# Altium project TDA_7000_FM_RECIEVER.PrjPcb
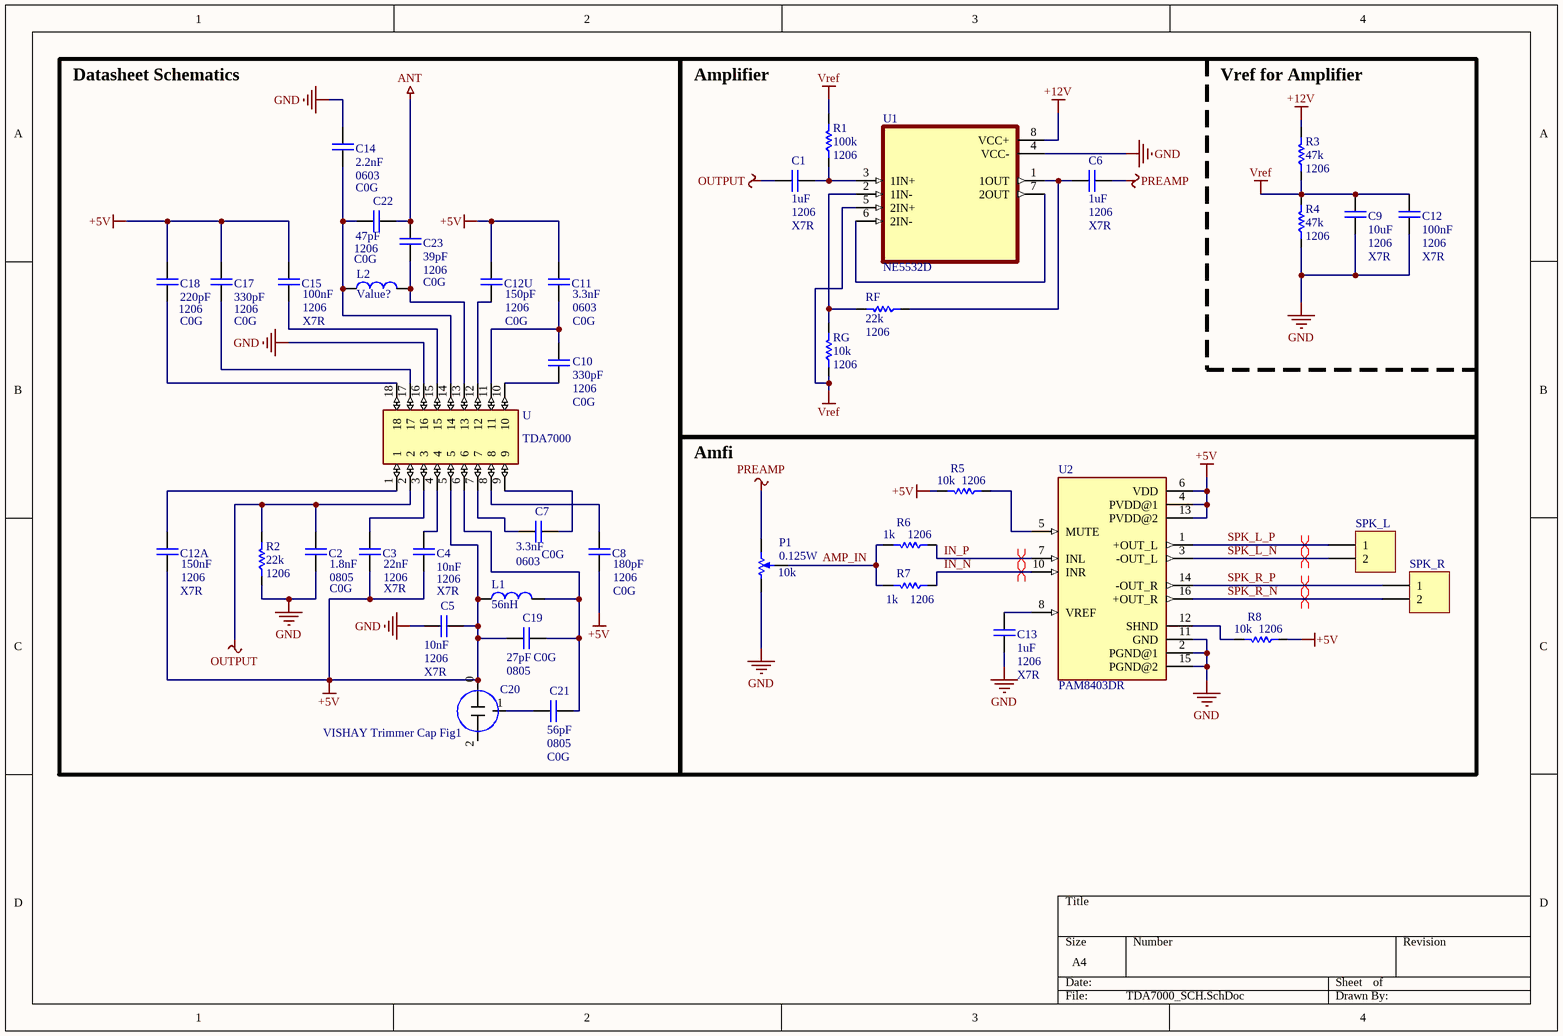
[diagram p0: TDA7000_SCH.SchDoc]
1 sheet, 42 parts. Net scope: global (net labels, ports and power ports of the same name join across sheets).
Board file: TDA7000_PCB.PcbDoc

## Sheet TDA7000_SCH.SchDoc
size A4; SheetNumber: 1; SheetTotal: 1

### Parts
C1  Package: 1206  Rating: X7R  [CAP 1206/3216]  (hidden comment: 1uF)
C2  Package: 0805  Rating: C0G  [CAP 0805/2012]  (hidden comment: 1.8nF)
C3  Package: 1206  Rating: X7R  [CAP 1206/3216]  (hidden comment: 22nF)
C4  Package: 1206  Rating: X7R  [CAP 1206/3216]  (hidden comment: 10nF)
C5  Package: 1206  Rating: X7R  [CAP 1206/3216]  (hidden comment: 10nF)
C6  Package: 1206  Rating: X7R  [CAP 1206/3216]  (hidden comment: 1uF)
C7  Package: 0603  Rating: C0G  [CAP 0603/1608]  (hidden comment: 3.3nF)
C8  Package: 1206  Rating: C0G  [CAP 1206/3216]  (hidden comment: 180pF)
C9  Package: 1206  Rating: X7R  [CAP 1206/3216]  (hidden comment: 10uF)
C10  Package: 1206  Rating: C0G  [CAP 1206/3216]  (hidden comment: 330pF)
C11  Package: 0603  Rating: C0G  [CAP 0603/1608]  (hidden comment: 3.3nF)
C12  Package: 1206  Rating: X7R  [CAP 1206/3216]  (hidden comment: 100nF)
C12A  Package: 1206  Rating: X7R  [CAP 1206/3216]  (hidden comment: 150nF)
C12U  Package: 1206  Rating: C0G  [CAP 1206/3216]  (hidden comment: 150pF)
C13  Package: 1206  Rating: X7R  [CAP 1206/3216]  (hidden comment: 1uF)
C14  Package: 0603  Rating: C0G  [CAP 0603/1608]  (hidden comment: 2.2nF)
C15  Package: 1206  Rating: X7R  [CAP 1206/3216]  (hidden comment: 100nF)
C17  Package: 1206  Rating: C0G  [CAP 1206/3216]  (hidden comment: 330pF)
C18  Package: 1206  Rating: C0G  [CAP 1206/3216]  (hidden comment: 220pF)
C19  Package: 0805  Rating: C0G  [CAP 1206/3216]  (hidden comment: 27pF)
C20  VISHAY Trimmer Cap Fig1  [FIG2]
C21  Package: 0805  Rating: C0G  [CAP 0805/2012]  (hidden comment: 56pF)
C22  Package: 1206  Rating: C0G  [CAP 1206/3216]  (hidden comment: 47pF)
C23  Package: 1206  Rating: C0G  [CAP 1206/3216]  (hidden comment: 39pF)
L1  56nH  [Inductor - 10uH (1/8)]
L2  Value?  [Inductor - 10uH (1/8)]
P1  Rating: 0.125W  [POT_WH148]  (hidden comment: 10k)
R1  Package: 1206  [RES 1206 (3216X08L)]  (hidden comment: 100k)
R2  Package: 1206  [RES 1206 (3216X08L)]  (hidden comment: 22k)
R3  Package: 1206  [RES 1206 (3216X08L)]  (hidden comment: 47k)
R4  Package: 1206  [RES 1206 (3216X08L)]  (hidden comment: 47k)
R5  Package: 1206  [RES 1206 (3216X08L)]  (hidden comment: 10k)
R6  Package: 1206  [RES 1206 (3216X08L)]  (hidden comment: 1k)
R7  Package: 1206  [RES 1206 (3216X08L)]  (hidden comment: 1k)
R8  Package: 1206  [RES 1206 (3216X08L)]  (hidden comment: 10k)
RF  Package: 1206  [RES 1206 (3216X08L)]  (hidden comment: 22k)
RG  Package: 1206  [RES 1206 (3216X08L)]  (hidden comment: 10k)
SPK_L  2  [HDR_THT_2F_2.54mm]  (value not drawn)
SPK_R  2  [HDR_THT_2F_2.54mm]  (value not drawn)
U  TDA7000  [DIP802W45P254L2180H470Q18]
U1  NE5532D  [SOIC127P599X175-8N]
U2  PAM8403DR  [SOIC127P605X150-16N]

### Blocks framed on the sheet
Datasheet Schematics: C2-C5 C7 C8 C10 C11 C12A C12U C14 C15 C17-C23 L1 L2 R2 U
Amplifier: C1 C6 R1 RF RG U1
Vref for Amplifier: C9 C12 R3 R4
Amfi: C13 P1 R5-R8 SPK_L SPK_R U2

### Nets
+5V: C3.2 C4.2 C5.2 C8.1 C11.2 C12A.2 C12U.2 C15.1 C17.1 C18.1 C19.1 C20.0 L1.1 R5.2 R8.1 U.5 U2.4(PVDD@1) U2.6(VDD) U2.13(PVDD@2)
+12V: R3.2 U1.8(VCC+)
ANT: C22.2 C23.2
GND: C2.2 C5.1 C9.1 C12.1 C13.1 C14.2 P1.3(CW) R2.1 R4.1 U.16 U1.4(VCC-) U2.2(PGND@1) U2.11(GND) U2.15(PGND@2)
OUTPUT: C1.1 C2.1 R2.2 U.2
PREAMP: C6.2 P1.1(CCW)
Vref: C9.2 C12.2 R1.2 R3.1 R4.2 RG.1 U1.5(2IN+)
AMP_IN: P1.2(WIPER) R6.2 R7.2
IN_N: R7.1 U2.10(INR)
IN_P: R6.1 U2.7(INL)
SPK_L_N: SPK_L.2 U2.3(-OUT_L)
SPK_L_P: SPK_L.1 U2.1(+OUT_L)
SPK_R_N: SPK_R.2 U2.16(+OUT_R)
SPK_R_P: SPK_R.1 U2.14(-OUT_R)
NetC1_2: C1.2 R1.1 U1.3(1IN+)
NetC3_1: C3.1 U.3
NetC4_1: C4.1 U.4
NetC6_1: C6.1 RF.1 U1.1(1OUT)
NetC7_1: C7.1 U.7
NetC7_2: C7.2 U.9
NetC8_2: C8.2 U.8
NetC10_1: C10.1 U.10
NetC10_2: C10.2 C11.1 U.11
NetC12A_1: C12A.1 U.1
NetC12U_1: C12U.1 U.12
NetC13_2: C13.2 U2.8(VREF)
NetC14_1: C14.1 C22.1 L2.1 U.14
NetC15_2: C15.2 U.15
NetC17_2: C17.2 U.17
NetC18_2: C18.2 U.18
NetC19_2: C19.2 C21.2 L1.2 U.6
NetC20_1: C20.1 C21.1
NetC23_1: C23.1 L2.2 U.13
NetR5_1: R5.1 U2.5(MUTE)
NetR8_2: R8.2 U2.12(SHND)
NetRF_2: RF.2 RG.2 U1.2(1IN-)
NetU1_6: U1.6(2IN-) U1.7(2OUT)

Not connected (* = marked no-connect by the designer): C20 2

### Layout directives
differential pair: IN_N, IN_P, SPK_L_N, SPK_L_P, SPK_R_N, SPK_R_P

### Library data of the parts
C1-C12 C12A C12U C13-C15 C17-C19 C21-C23 = Cap_Multi_SMD: Bipolar ceramic capacitor SMD; Inflow: inflow?; Type: Type?; Validation: Valid
  C1 C6 C13: Value: 1uF
  C2: Value: 1.8nF
  C3: Value: 22nF
  C4 C5: Value: 10nF
  C7 C11: Value: 3.3nF
  C8: Value: 180pF
  C9: Value: 10uF
  C10 C17: Value: 330pF
  C12 C15: Value: 100nF
  C12A: Value: 150nF
  C12U: Value: 150pF
  C14: Value: 2.2nF
  C18: Value: 220pF
  C19: Value: 27pF
  C21: Value: 56pF
  C22: Value: 47pF
  C23: Value: 39pF
L1 L2 = Ind_THT: Inductor; Rating: Rating?; Type: Type?; Validation: NT; Inflow: inflow?; Package: Package?
  L1: Value: 56nH
  L2: Value: Value?
P1 = Res_Pot: Potentiometer; Validation: Valid; Inflow: inflow?; Package: Package?; Type: Type?; Value: 10k
R1-R8 RF RG = Res_SMD: Resistor; Inflow: inflow?; Rating: Rating?; Validation: Valid; Type: 10%
  R1: Value: 100k
  R2 RF: Value: 22k
  R3 R4: Value: 47k
  R5 R8 RG: Value: 10k
  R6 R7: Value: 1k
SPK_L SPK_R = Con_FPH_2x1_V_THT_2.54: Header, single row, 2 pin; Inflow: 8101; Rating: Rating?; Validation: NT; Value: 2; Package: Package?; Type: Type?
U = TDA7000: MF: MCM Electronics; Package: DIP-18 MCM Electronics; MP: TDA7000; Price: None; Availability: Unavailable; Value: *; SnapEDA_Link: https://www.snapeda.com/parts/TDA7000/MCM%20Electronics/view-part/577349/?ref=snap
U1 = NE5532D: Dual, 30-V, 10-MHz, low-noise operational amplifier for audio applications; MF: Texas Instruments; SnapEDA_Link: https://www.snapeda.com/parts/NE5532D/Texas+Instruments/view-part/?ref=snap; Package: SOIC-8 Texas Instruments; Value: *; MP: NE5532D; Check_prices: https://www.snapeda.com/parts/NE5532D/Texas+Instruments/view-part/?ref=eda
U2 = PAM8403DR: Amplifiers, Audio, 3W STEREO FILTERLESS CLASS-D AUDIO AMP | Diodes Inc PAM8403DR; MF: Diodes Inc.; SnapEDA_Link: https://www.snapeda.com/parts/PAM8403DR/Diodes+Inc./view-part/?ref=snap; Package: SOP-16 Diodes Inc.; Value: *; MP: PAM8403DR; Check_prices: https://www.snapeda.com/parts/PAM8403DR/Diodes+Inc./view-part/?ref=eda